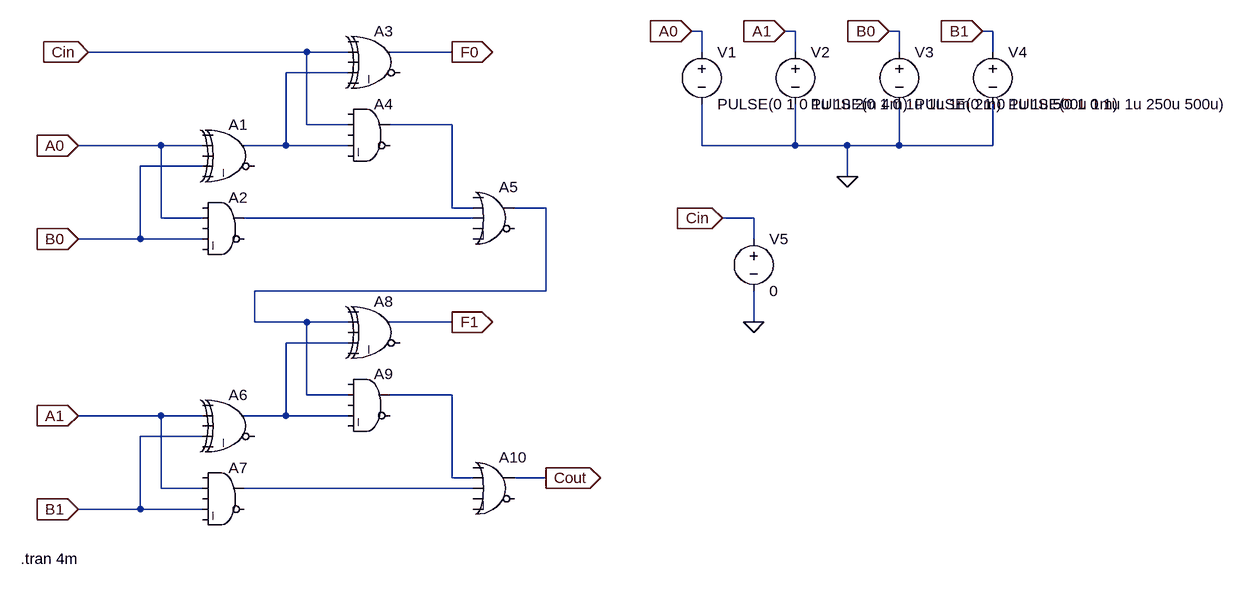
[diagram p0: schematic 2Bit Adder.asc]
2Bit Adder.asc, the LTspice schematic file:
Version 4
SHEET 1 880 1512
WIRE -192 -208 -208 -208
WIRE -48 -208 -64 -208
WIRE 112 -208 96 -208
WIRE 256 -208 240 -208
WIRE -800 -176 -1136 -176
WIRE -736 -176 -800 -176
WIRE -576 -176 -672 -176
WIRE -192 -176 -192 -208
WIRE -48 -176 -48 -208
WIRE 112 -176 112 -208
WIRE 256 -176 256 -208
WIRE -736 -144 -832 -144
WIRE -800 -64 -800 -176
WIRE -736 -64 -800 -64
WIRE -576 -64 -672 -64
WIRE -1024 -32 -1152 -32
WIRE -960 -32 -1024 -32
WIRE -832 -32 -832 -144
WIRE -832 -32 -896 -32
WIRE -736 -32 -832 -32
WIRE -192 -32 -192 -96
WIRE -48 -32 -48 -96
WIRE -48 -32 -192 -32
WIRE 32 -32 -48 -32
WIRE 112 -32 112 -96
WIRE 112 -32 32 -32
WIRE 256 -32 256 -96
WIRE 256 -32 112 -32
WIRE -960 0 -1056 0
WIRE 32 16 32 -32
WIRE -576 64 -576 -64
WIRE -544 64 -576 64
WIRE -432 64 -480 64
WIRE -1024 80 -1024 -32
WIRE -960 80 -1024 80
WIRE -544 80 -896 80
WIRE -112 80 -160 80
WIRE -1056 112 -1056 0
WIRE -1056 112 -1152 112
WIRE -960 112 -1056 112
WIRE -112 112 -112 80
WIRE -432 192 -432 64
WIRE -432 192 -880 192
WIRE -880 240 -880 192
WIRE -800 240 -880 240
WIRE -736 240 -800 240
WIRE -576 240 -672 240
WIRE -112 240 -112 192
WIRE -736 272 -832 272
WIRE -800 352 -800 240
WIRE -736 352 -800 352
WIRE -576 352 -672 352
WIRE -1024 384 -1152 384
WIRE -960 384 -1024 384
WIRE -832 384 -832 272
WIRE -832 384 -896 384
WIRE -736 384 -832 384
WIRE -960 416 -1056 416
WIRE -576 480 -576 352
WIRE -544 480 -576 480
WIRE -432 480 -480 480
WIRE -1024 496 -1024 384
WIRE -960 496 -1024 496
WIRE -544 496 -896 496
WIRE -1056 528 -1056 416
WIRE -1056 528 -1152 528
WIRE -960 528 -1056 528
FLAG -1152 -32 A0
IOPIN -1152 -32 In
FLAG -1152 112 B0
IOPIN -1152 112 In
FLAG -1136 -176 Cin
IOPIN -1136 -176 In
FLAG -576 -176 F0
IOPIN -576 -176 Out
FLAG -1152 384 A1
IOPIN -1152 384 In
FLAG -1152 528 B1
IOPIN -1152 528 In
FLAG -576 240 F1
IOPIN -576 240 Out
FLAG -432 480 Cout
IOPIN -432 480 Out
FLAG 32 16 0
FLAG -208 -208 A0
IOPIN -208 -208 In
FLAG -64 -208 A1
IOPIN -64 -208 In
FLAG 96 -208 B0
IOPIN 96 -208 In
FLAG 240 -208 B1
IOPIN 240 -208 In
FLAG -160 80 Cin
IOPIN -160 80 In
FLAG -112 240 0
SYMBOL Digital\\xor -912 -80 R0
SYMATTR InstName A1
SYMBOL Digital\\and -928 32 R0
SYMATTR InstName A2
SYMBOL Digital\\xor -688 -224 R0
SYMATTR InstName A3
SYMBOL Digital\\and -704 -112 R0
SYMATTR InstName A4
SYMBOL Digital\\or -512 16 R0
SYMATTR InstName A5
SYMBOL Digital\\xor -912 336 R0
SYMATTR InstName A6
SYMBOL Digital\\and -928 448 R0
SYMATTR InstName A7
SYMBOL Digital\\xor -688 192 R0
SYMATTR InstName A8
SYMBOL Digital\\and -704 304 R0
SYMATTR InstName A9
SYMBOL Digital\\or -512 432 R0
SYMATTR InstName A10
SYMBOL voltage -192 -192 R0
WINDOW 123 0 0 Left 0
WINDOW 39 0 0 Left 0
SYMATTR InstName V1
SYMATTR Value PULSE(0 1 0 1u 1u 2m 4m)
SYMBOL voltage -48 -192 R0
WINDOW 123 0 0 Left 0
WINDOW 39 0 0 Left 0
SYMATTR InstName V2
SYMATTR Value PULSE(0 1 0 1u 1u 1m 2m)
SYMBOL voltage 112 -192 R0
WINDOW 123 0 0 Left 0
WINDOW 39 0 0 Left 0
SYMATTR InstName V3
SYMATTR Value PULSE(0 1 0 1u 1u 500u 1m)
SYMBOL voltage 256 -192 R0
WINDOW 123 0 0 Left 0
WINDOW 39 0 0 Left 0
SYMATTR InstName V4
SYMATTR Value PULSE(0 1 0 1u 1u 250u 500u)
SYMBOL voltage -112 96 R0
WINDOW 123 0 0 Left 0
WINDOW 39 0 0 Left 0
SYMATTR InstName V5
SYMATTR Value 0
TEXT -1240 604 Left 2 !.tran 4m

The netlist it stands for:
* 2Bit Adder.asc
A1 0 A0 0 B0 0 0 N001 0 XOR
A2 0 A0 0 B0 0 0 N004 0 AND
A3 0 Cin 0 N001 0 0 F0 0 XOR
A4 0 Cin 0 N001 0 0 N002 0 AND
A5 0 N002 N004 0 0 0 N003 0 OR
A6 0 A1 0 B1 0 0 N005 0 XOR
A7 0 A1 0 B1 0 0 N007 0 AND
A8 0 N003 0 N005 0 0 F1 0 XOR
A9 0 N003 0 N005 0 0 N006 0 AND
A10 0 N006 N007 0 0 0 Cout 0 OR
V1 A0 0 PULSE(0 1 0 1u 1u 2m 4m)
V2 A1 0 PULSE(0 1 0 1u 1u 1m 2m)
V3 B0 0 PULSE(0 1 0 1u 1u 500u 1m)
V4 B1 0 PULSE(0 1 0 1u 1u 250u 500u)
V5 Cin 0 0
.tran 4m
.backanno
.end